# Altium schematic sheet Input Buffer.SchDoc: Analog_Distotion_Gitar_Pedal
size 431 x 279 mm; Date: *******; ApprovedBy: *******; CheckedBy: Dahami Fernando; Author: *******; CompanyName: *******; DrawnBy: Rivikula Fernando; Engineer: *******; Organization: *******; Address1: *******; Address2: *******; Address3: *******; Address4: *******; DocumentNumber: 2; Revision: *******; SheetNumber: 2; SheetTotal: 7; Subtitle: Input Buffer; Project: Distotion_Gitar_Pedal; VersionRevision: 1; TotalSheet: 8; CurrentTime: *******; CurrentDate: *******; Time: *******; DocumentFullPathAndName: *******; DocumentName: *******; ModifiedDate: *******; ImagePath: *******; ProjectName: *******; Application_BuildNumber: *******
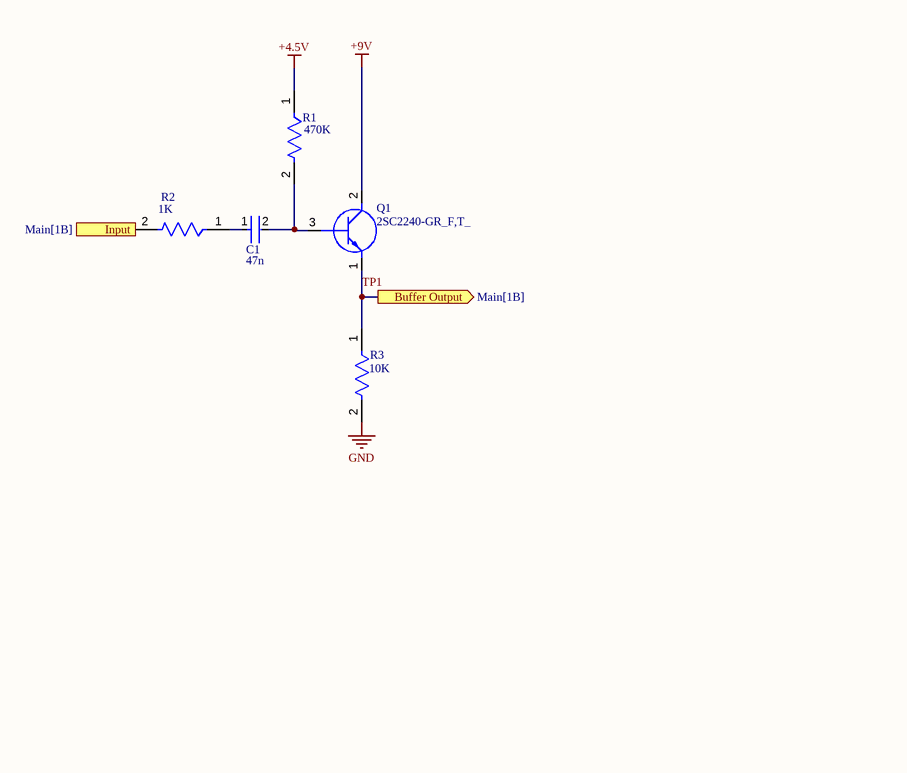
[diagram p0: Input Buffer.SchDoc]

## Parts
C1  47n  [FP-RCE1A2-MFG]
Q1  2SC2240-GR_F,T_  [SSM3K7002CFULF]
R1  470K  [FP-MRS1600-MFG]
R2  1K  [FP-MRS1600-MFG]
R3  10K  [FP-MRS1600-MFG]

## Ports
Buffer Output (out, see Main[1B]), Input (in, see Main[1B])

## Nets
+4.5V: R1.1
+9V: Q1.2(C)
GND: R3.2
Input: R2.2 ; port Input
TP1: Q1.1(E) R3.1 ; port Buffer Output
NetC1_1: C1.1 R2.1
NetC1_2: C1.2 Q1.3(B) R1.2

## Notes on the sheet
- DWG. NO.
- REV.
- SHT.
- THIS DOCUMENT AND THE DATA DISCLOSED HEREIN OR HEREWITH IS THE PROPERTY OF ALTIUM LIMITED AND MAY BE FREELY DISTRIBUTED IN WHOLE. NO RIGHTS ARE RESERVED OR EXPRESS OR IMPLIED WARANTEE GIVEN.
- REVISION
- DESCRIPTION
- DATE
- APPROVED
- ENG:
- APPROVALS
- PROJECT
- DSN:
- CHK:
- REFERENCE DOCUMENTS
- PROJECT REVISION:
- TITLE
- DOCUMENT REVISION:
- DESIGN ITEM:
- BOM:
- FAB DWG:
- PCB DWG:
- ASSY DWG:
- SCALE:
- SIZE
- B
- CAGE CODE
- FILE NAME
- DWG NO.
- SHEET
- OF
- REV

## Library data of the parts
C1 = CMP-06035-023167-1: Cap Ceramic 100nF 100V X7R ±10% Radial 2.5mm +125°C Automotive Bulk; Lead Diameter: 0.5mm; Lead/Base Style: Straight; Resistor Type: Ceramic; Ratings: AEC-Q200; Mount: Through Hole; Termination: Radial; Capacitance: 100nF; Voltage Rating (DC): 100V; Max Operating Temperature: 125°C; Min Operating Temperature: -55°C; Case/Package: Radial; Tolerance: 10%; Length: 0.157inch; Voltage Rating: 100V; Width: 0.098inch; Packaging: Bulk; Package Quantity: 500; Lead Free: Lead Free; Height: 3.5mm; Dielectric: X7R; Height - Seated (Max): 0.138inch; Lead Pitch: 0.098inch
Q1 = 2SC2240-GR_F,T_: Transistor BJT NPN; Manufacturer_Name: Toshiba; Manufacturer_Part_Number: 2SC2240-GR(F,T); Datasheet Link: https://datasheet.octopart.com/2SC2240GR-Toshiba-datasheet-109832.pdf; Mouser Part Number: 757-2SC2240-GRFT; Mouser Price/Stock: https://www.mouser.co.uk/ProductDetail/Toshiba/2SC2240-GRFT?qs=%2FsslhGPpiOR3XjNwkR44HA%3D%3D
R1-R3 = CMP-02408-000019-1: RES 20K OHM 0.4W 1% AXIAL; Max Power Dissipation: 400mW; Temperature Coefficient: 50ppm/°C; Resistance: 20kR; Technology: THIN FILM; Max Operating Temperature: 155°C; Number of Terminations: 2; RoHS Compliant: Yes; Packaging: Tape and Reel; Radiation Hardening: No; Contact Plating: Tin; Military Standard: Not; Construction: Cylindrical; Diameter: 1.6mm; Tolerance: 1%; Mount: Through Hole; Power Rating: 400mW; Case/Package: Conformal; Termination: Axial; Length: 3.6mm; Min Operating Temperature: -55°C; Resistor Type: Metal Film; Series: MRS16